# Altium project PCB_Project.PrjPcb
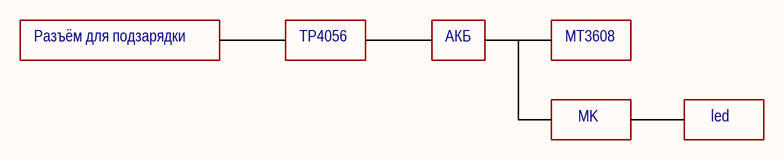
[diagram p0: Sheet1_Блок-схема.SchDoc]
2 sheets, 22 parts. Net scope: flat (ports and power ports of the same name join across sheets).
Sheets:
  Sheet1_Блок-схема.SchDoc
  Sheet1.SchDoc

## Sheet Sheet1_Блок-схема.SchDoc
size 420 x 297 mm; Address1: Address1; Address2: Address2; Address3: Address3; Address4: Address4; DocumentNumber: АБВГ.123456.001 Э3; SheetNumber: 1; Scale: 1:1; DocumentType: Схема электрическая принципиальная; FirstReferrence: АБВГ.123456.001

### Notes on the sheet
- Разъём для подзарядки
- TP4056
- АКБ
- MT3608
- MK
- led
- Перв. примен.
- Справ. №
- Подп. и дата
- Инв. № дубл.
- Взам. инв. №
- Разраб.
- Изм.
- Лист
- № докум.
- Подп.
- Дата
- Лит.
- Масса
- Масштаб
- Пров.
- Т.контр.
- Листов
- Инв. № подл.
- Утв.
- Н.контр.
- 2.106-A3
- Копировал
- Формат А3

## Sheet Sheet1.SchDoc
size 420 x 297 mm; Address1: Address1; Address2: Address2; Address3: Address3; Address4: Address4; DocumentNumber: АБВГ.123456.001 Э3; SheetNumber: 1; Scale: 1:1; DocumentType: Схема электрическая принципиальная; FirstReferrence: АБВГ.123456.001
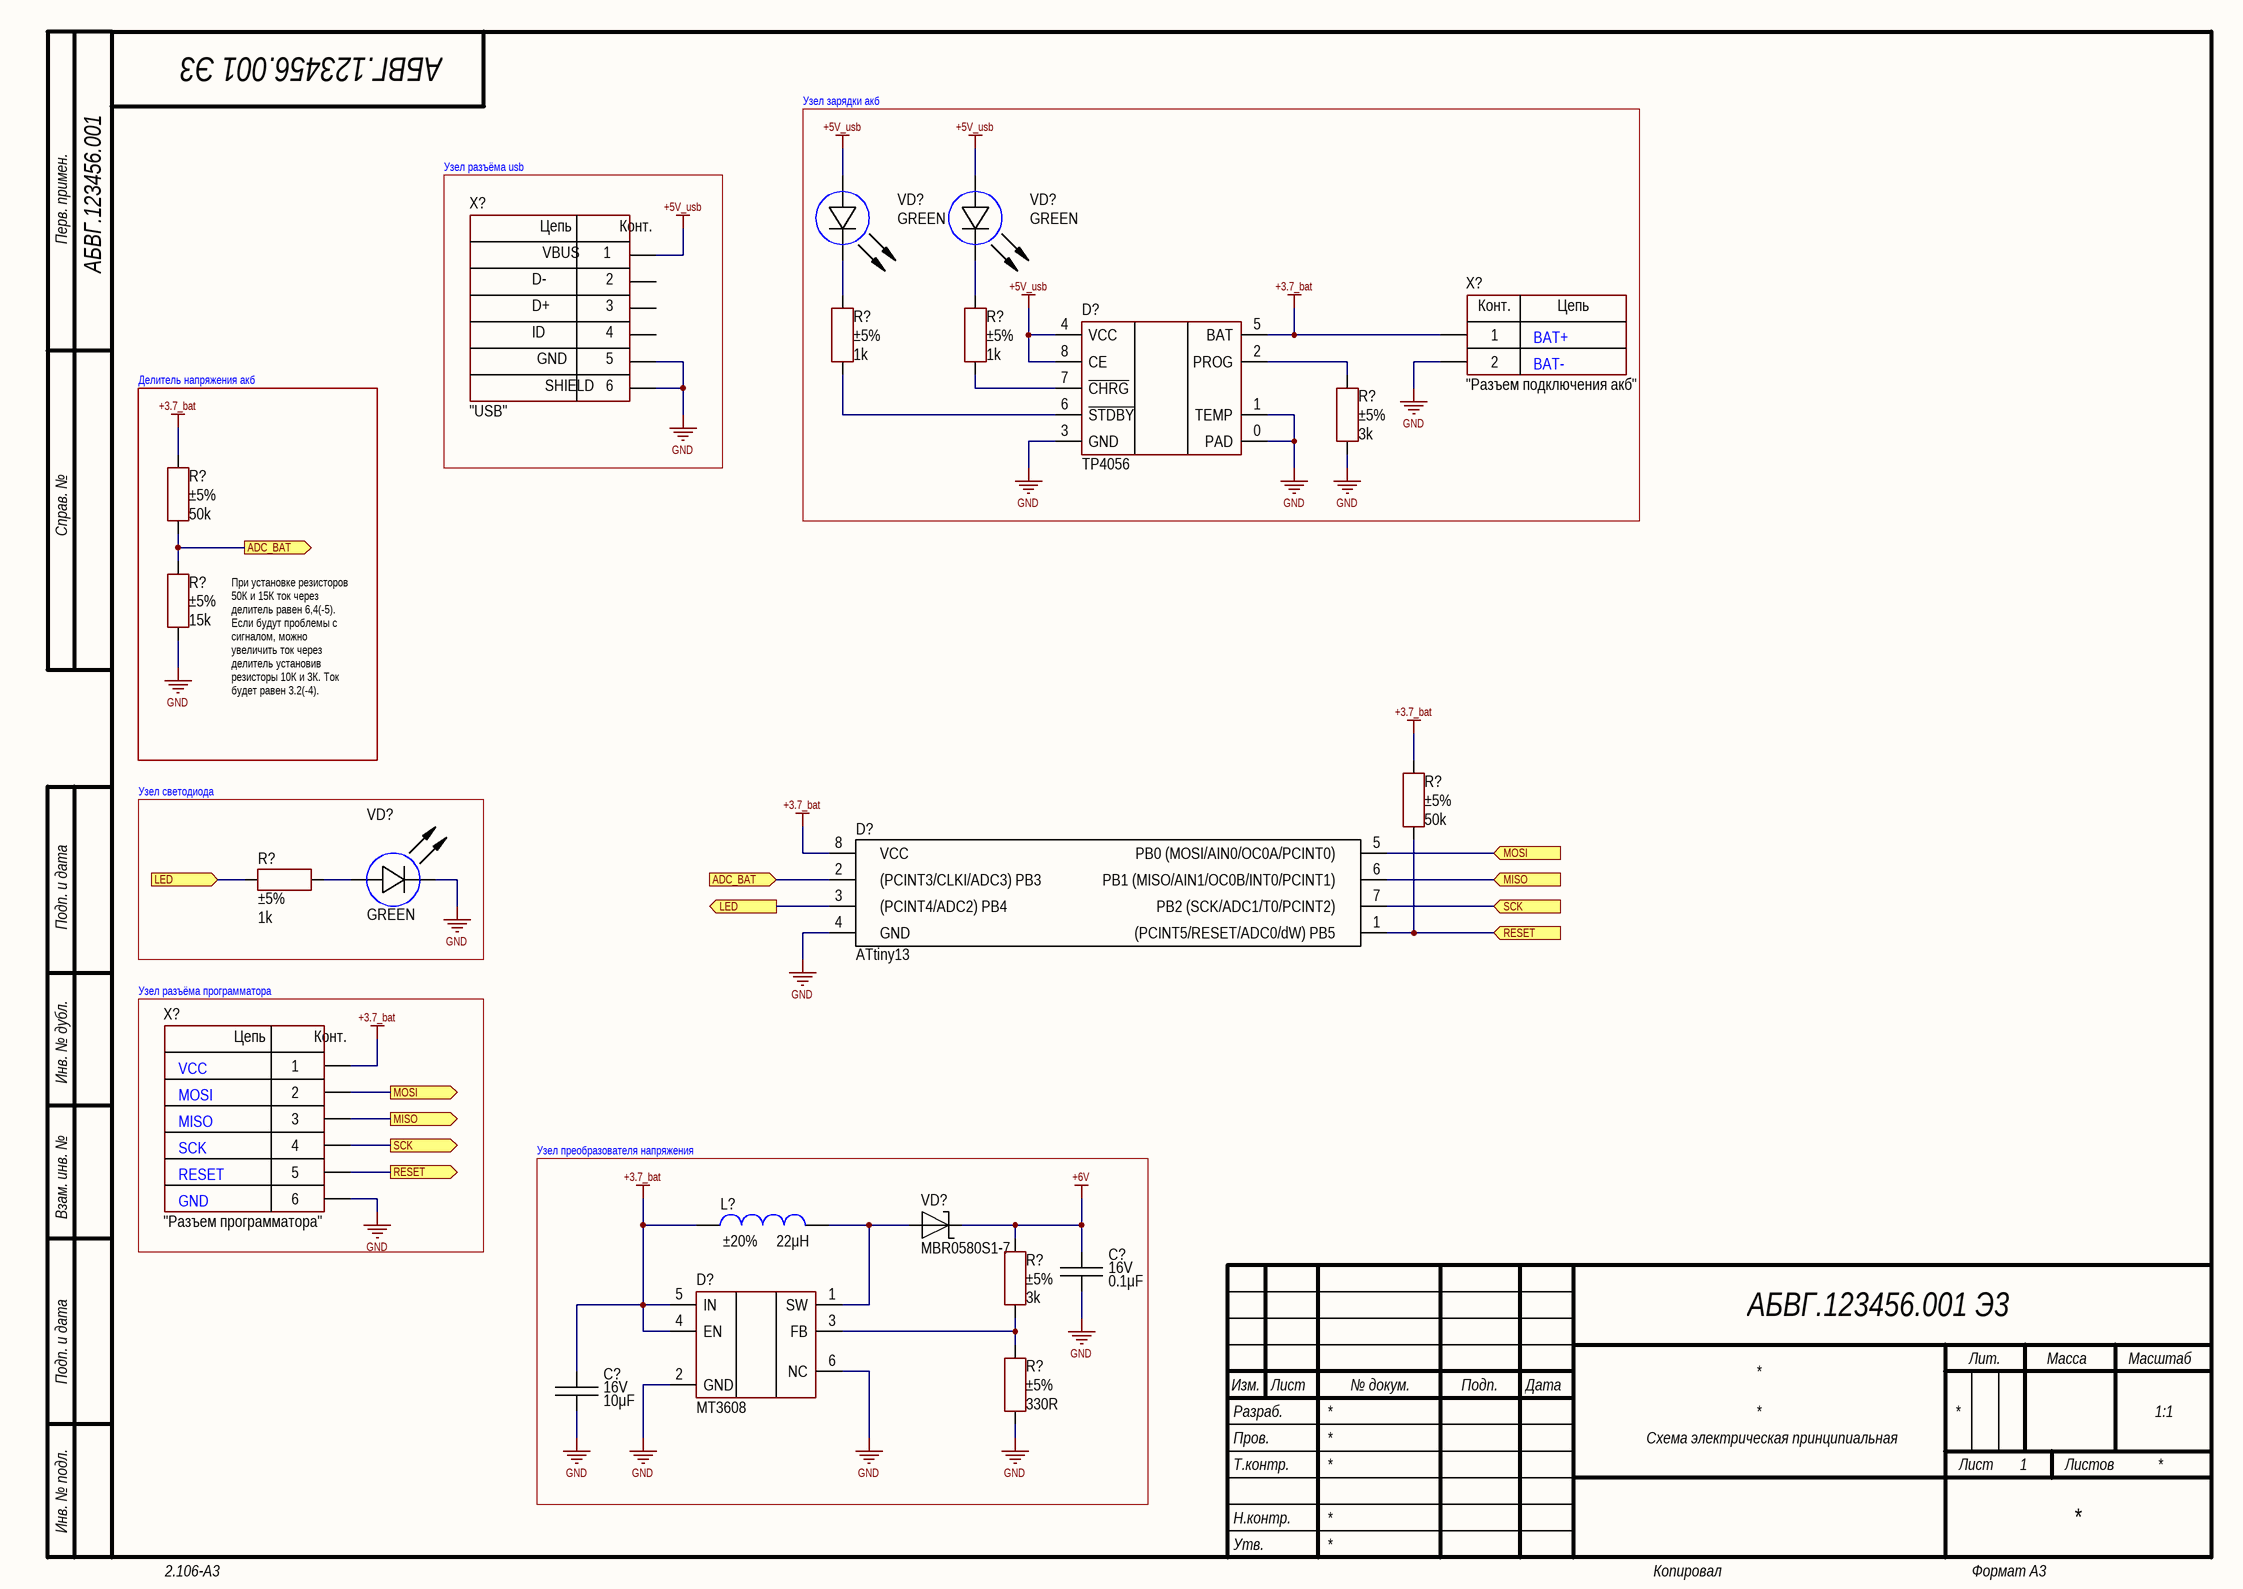
[diagram p1: Sheet1.SchDoc]

### Parts
(Parts that share a designator on the sheet are numbered #1, #2 ... from top to bottom, then left to right.)
C?#1  value 0.1μF  Voltage: 16V  [CAP: 0603]
C?#2  value 10μF  Voltage: 16V  [CAP: 0603]
D?#1  (no value)  [8-SOIC-PAD]
D?#2  (no value)  [8-SOIC]
D?#3  (no value)  [SOT23-6]
L?  value 22μH  Tolerance: ±20%  [CDRH]
R?#1  value 1k  Tolerance: ±5%  [RES: 0603]
R?#2  value 1k  Tolerance: ±5%  [RES: 0603]
R?#3  value 3k  Tolerance: ±5%  [RES: 0603]
R?#4  value 50k  Tolerance: ±5%  [RES: 0603]
R?#5  value 15k  Tolerance: ±5%  [RES: 0603]
R?#6  value 50k  Tolerance: ±5%  [RES: 0603]
R?#7  value 1k  Tolerance: ±5%  [RES: 0603]
R?#8  value 3k  Tolerance: ±5%  [RES: 0603]
R?#9  value 330R  Tolerance: ±5%  [RES: 0603]
VD?#1  Color: GREEN  [LED: 0805B]
VD?#2  Color: GREEN  [LED: 0805B]
VD?#3  Color: GREEN  [LED: 0805B]
VD?#4  PartNumber: MBR0580S1-7  [DIODE: SMA]
X?#1  CommentText: "USB"  [CON: USB micro-A (ZX62-B-5PA)]
X?#2  CommentText: "Разъем подключения акб"  [CON: PLS-2]
X?#3  CommentText: "Разъем программатора"  [CON: PLS-6]

### Blocks framed on the sheet
Узел разъёма usb: X?#1
Делитель напряжения акб: R?#4 R?#5
Узел светодиода: R?#7 VD?#3
Узел преобразователя напряжения: C?#1 C?#2 D?#3 L? R?#8 R?#9 VD?#4

### Ports
ADC_BAT (in), ADC_BAT (out), LED (in), LED (out), MISO (in), MISO (out), MOSI (in), MOSI (out), RESET (in), RESET (out), SCK (in), SCK (out)

### Nets
+3.7_bat: C?#2.2 D?#1.5(BAT) D?#2.8(VCC) D?#3.4(EN) D?#3.5(IN) L?.2 R?#4.2 R?#6.2 X?#2.1 X?#3.1
+5V_usb: D?#1.4(VCC) D?#1.8(CE) VD?#1.1(A) VD?#2.1(A) X?#1.1
+6V: C?#1.1 R?#8.2 VD?#4.2
GND: C?#1.2 C?#2.1 D?#1.0(PAD) D?#1.1(TEMP) D?#1.3(GND) D?#2.4(GND) D?#3.2(GND) D?#3.6(NC) R?#3.1 R?#5.1 R?#9.1 VD?#3.2(C) X?#1.0 X?#1.5 X?#2.2 X?#3.6
NetD?#1_2: D?#1.2(PROG) R?#3.2
NetD?#1_6: D?#1.6(~{STDBY}) R?#1.2
NetD?#1_7: D?#1.7(~{CHRG}) R?#2.2
NetD?#2_1: D?#2.1((PCINT5/RESET/ADC0/dW)_PB5) R?#6.1 X?#3.5 ; port RESET
NetD?#2_2: D?#2.2((PCINT3/CLKI/ADC3)_PB3) R?#4.1 R?#5.2 ; port ADC_BAT
NetD?#2_3: D?#2.3((PCINT4/ADC2)_PB4) R?#7.2 ; port LED
NetD?#2_5: D?#2.5(PB0_(MOSI/AIN0/OC0A/PCINT0)) X?#3.2 ; port MOSI
NetD?#2_6: D?#2.6(PB1_(MISO/AIN1/OC0B/INT0/PCINT1)) X?#3.3 ; port MISO
NetD?#2_7: D?#2.7(PB2_(SCK/ADC1/T0/PCINT2)) X?#3.4 ; port SCK
NetD?#3_1: D?#3.1(SW) L?.1 VD?#4.1
NetD?#3_3: D?#3.3(FB) R?#8.1 R?#9.2
NetR?#1_1: R?#1.1 VD?#1.2(C)
NetR?#2_1: R?#2.1 VD?#2.2(C)
NetR?#7_1: R?#7.1 VD?#3.1(A)

Not connected (* = marked no-connect by the designer): X?#1 2 3 4

### Notes on the sheet
- Узел зарядки акб
- BAT+
- BAT-
- (near R?#5) При установке резисторов 50К и 15К ток через делитель равен 6,4(-5).
  Если будут проблемы с сигналом, можно увеличить ток через делитель установив резисторы 10К и 3К. Ток будет равен 3.2(-4).
- Узел разъёма программатора
- VCC
- MOSI
- MISO
- SCK
- RESET
- GND
- Перв. примен.
- Справ. №
- Подп. и дата
- Инв. № дубл.
- Взам. инв. №
- Разраб.
- Изм.
- Лист
- № докум.
- Подп.
- Дата
- Лит.
- Масса
- Масштаб
- Пров.
- Т.контр.
- Листов
- Инв. № подл.
- Утв.
- Н.контр.
- 2.106-A3
- Копировал
- Формат А3
- (in symbol Connector_USB_micro_B) Цепь; Конт.; VBUS; D-; D+; ID; GND; SHIELD; 6
- (in symbol PLS-2) Конт.; Цепь
- (in symbol PLS-6) Цепь; Конт.

### Library data of the parts
C?#1 = Ceramic_0603: Manufacturer: Yageo; PartNumber: CC0603KRX7R7BB104; ValueManufacturerPartNumber: Ceramic capacitor, 0.1μF, X7R, ±10%, 16V, 0603, -55...+125°C; TypeCapacitor: Ceramic capacitor; Tolerance: ±10%; TypeDielectric: X7R; Package: 0603; HelpURL: https://www.digikey.com/product-detail/en/yageo/CC0603KRX7R7BB104/311-1088-1-ND/302998; Temperature: -55...+125°C
C?#2 = Ceramic_0603: Manufacturer: Yageo; PartNumber: CC0603KRX7R7BB104; ValueManufacturerPartNumber: Ceramic capacitor, 10μF, X7R, ±10%, 16V, 0603, -55...+125°C; TypeCapacitor: Ceramic capacitor; Tolerance: ±10%; TypeDielectric: X7R; Package: 0603; HelpURL: https://www.digikey.com/product-detail/en/yageo/CC0603KRX7R7BB104/311-1088-1-ND/302998; Temperature: -55...+125°C
D?#1 = TP4056: Li-lon Battery Charger; CurrentOutput: 1A; HelpURL: https://dlnmh9ip6v2uc.cloudfront.net/datasheets/Prototyping/TP4056.pdf; Package: SOP-8; ComponentType: 1A Standalone Linear Li-lon Battery Charger with Thermal; ValueManufacturerPartNumber: =ComponentType+', '+VoltageInput+', '+Frequency+', '+VoltageOutput+', '+CurrentOutput+', '+Temperature+', '+Package; Temperature: -40...+85°C; PartNumber: TP4056
D?#2 = ATtiny13: 8-bit / Microcontroller / with 1K Bytes / In-System / Programmable / Flash; Manufacturer: ATmel; Supply: 2.7...5.5V; Speed: 9.8MHz; MemoryROM: 1024B; MemoryRAM: 64KB; HelpURL: http://ww1.microchip.com/downloads/en/DeviceDoc/2535S.pdf; Package: 8-DIP; ComponentType: IC microcontroller; ValueManufacturerPartNumber: =ComponentType+', '+CoreSize+', '+CoreProcessor+', '+Speed+', '+MemoryROM+', '+MemoryRAM+', '+Supply+', '+Temperature+', '+Package; Temperature: -40...+85°C; CoreSize: 8-Bit; PartNumber: ATtiny13
D?#3 = MT3608: Step Up Converter; HelpURL: https://www.olimex.com/Products/Breadboarding/BB-PWR-3608/resources/MT3608.pdf; Package: SOT23-6; ComponentType: High Efficiency 1.2MHz; ValueManufacturerPartNumber: =ComponentType+', '+VoltageInput+', '+MaxDropout+', '+VoltageOutput+', '+CurrentOutput+', '+Temperature+', '+Package; Temperature: -40...+85°C; PartNumber: MT3608
L? = Inductor_CDRH: Manufacturer: Bourns; ValueManufacturerPartNumber: Fixed inductor, 22μH, ±20%, CDRH101R, 3A, -40...+150°C; TypeInductor: Fixed inductor; MaxCurrent: 3A; PartNumber: CDRH; Package: CDRH101R; HelpURL: https://aliexpress.ru/item/32956142172.html?spm=a2g0s.9042311.0.0.f06533edih9Buf; Temperature: -40...+150°C
R?#1 R?#2 R?#7 = Resistor_0603: Manufacturer: Yageo; PartNumber: RC0603JR-07100RL; ValueManufacturerPartNumber: Resistor film, 1k, ±5%, 0603, 0.1W, -55...+125°C; TypeResistor: Resistor film; Power: 0.1W; Package: 0603; HelpURL: https://www.digikey.com/product-detail/en/yageo/RC0603JR-07100RL/311-100GRCT-ND/729644; Temperature: -55...+125°C
R?#3 R?#8 = Resistor_0603: Manufacturer: Yageo; PartNumber: RC0603JR-07100RL; ValueManufacturerPartNumber: Resistor film, 3k, ±5%, 0603, 0.1W, -55...+125°C; TypeResistor: Resistor film; Power: 0.1W; Package: 0603; HelpURL: https://www.digikey.com/product-detail/en/yageo/RC0603JR-07100RL/311-100GRCT-ND/729644; Temperature: -55...+125°C
R?#4 R?#6 = Resistor_0603: Manufacturer: Yageo; PartNumber: RC0603JR-07100RL; ValueManufacturerPartNumber: Resistor film, 50k, ±5%, 0603, 0.1W, -55...+125°C; TypeResistor: Resistor film; Power: 0.1W; Package: 0603; HelpURL: https://www.digikey.com/product-detail/en/yageo/RC0603JR-07100RL/311-100GRCT-ND/729644; Temperature: -55...+125°C
R?#5 = Resistor_0603: Manufacturer: Yageo; PartNumber: RC0603JR-07100RL; ValueManufacturerPartNumber: Resistor film, 15k, ±5%, 0603, 0.1W, -55...+125°C; TypeResistor: Resistor film; Power: 0.1W; Package: 0603; HelpURL: https://www.digikey.com/product-detail/en/yageo/RC0603JR-07100RL/311-100GRCT-ND/729644; Temperature: -55...+125°C
R?#9 = Resistor_0603: Manufacturer: Yageo; PartNumber: RC0603JR-07100RL; ValueManufacturerPartNumber: Resistor film, 330R, ±5%, 0603, 0.1W, -55...+125°C; TypeResistor: Resistor film; Power: 0.1W; Package: 0603; HelpURL: https://www.digikey.com/product-detail/en/yageo/RC0603JR-07100RL/311-100GRCT-ND/729644; Temperature: -55...+125°C
VD?#1-VD?#3 = LED_single: ValueManufacturerPartNumber: LED, Green, *, *, *, -55...+150°C; TypeDiode: LED; Manufacturer: *; Package: *; HelpURL: *; Temperature: -55...+150°C; Current: *; VoltageDrop: *; PartNumber: *; ColorParameter: Green
VD?#4 = Schottky_single: Manufacturer: Diodes Incorporated; ValueManufacturerPartNumber: Schottky diode, 80V, 500mA, 1V, 15pF, SOD-123, -55...+150°C; TypeDiode: Schottky diode; Voltage: 80V; Current: 500mA; VoltageDrop: 1V; RecoveryTime: 15pF; Package: SOD-123; HelpURL: https://www.digikey.com/product-detail/en/diodes-incorporated/MBR0580S1-7/MBR0580S1-7DICT-ND/5080371; Temperature: -55...+150°C
X?#1 = Connector_USB_micro_B: Manufacturer: Hirose Electric; ValueManufacturerPartNumber: USB micro B; PartNumber: ZX62-B-5PA; HelpURL: https://www.digikey.com/product-detail/en/hirose-electric-co-ltd/ZX62-B-5PA/H11579CT-ND/1851090; TypeConnector: USB micro B
X?#2 = PLS-2: Manufacturer: Connfly; ValueManufacturerPartNumber: Connector, 2pin, 2.54mm, 500VAC, 3A; TypeConnector: Connector; VoltageMax: 500VAC; Pitch: 2.54mm; CurrentMax: 3A; Multichannel: 2pin; HelpURL: https://www.chipdip.ru/product/pls-2; PartNumber: PLS-2
X?#3 = PLS-6: Manufacturer: Connfly; ValueManufacturerPartNumber: Connector, 6pin, 2.54mm, 500VAC, 3A; TypeConnector: Connector; VoltageMax: 500VAC; Pitch: 2.54mm; CurrentMax: 3A; Multichannel: 6pin; HelpURL: https://www.chipdip.ru/product/pls-6; PartNumber: PLS-6